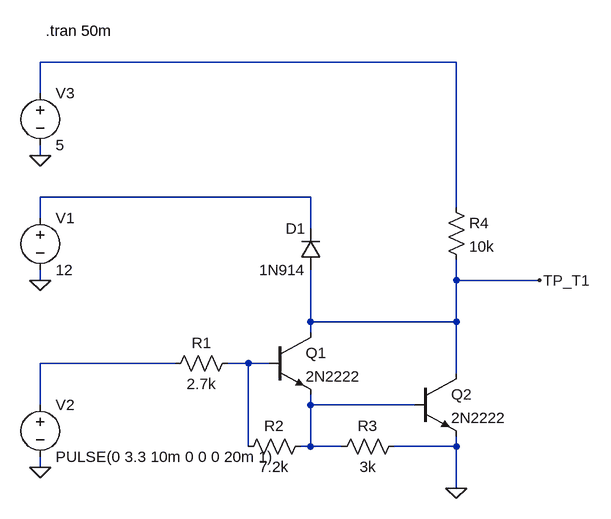
[diagram p0: schematic 4020 Control 1.asc]
4020 Control 1.asc, the LTspice schematic file:
Version 4
SHEET 1 880 680
WIRE 320 -288 -320 -288
WIRE -320 -240 -320 -288
WIRE -320 -144 -320 -160
WIRE 96 -80 -320 -80
WIRE 320 -64 320 -288
WIRE -320 -48 -320 -80
WIRE 96 -32 96 -80
WIRE -320 48 -320 32
WIRE 320 48 320 16
WIRE 448 48 320 48
WIRE 96 112 96 32
WIRE 320 112 320 48
WIRE 320 112 96 112
WIRE 96 128 96 112
WIRE -112 176 -320 176
WIRE 0 176 -32 176
WIRE 32 176 0 176
WIRE 320 192 320 112
WIRE -320 240 -320 176
WIRE 96 240 96 224
WIRE 256 240 96 240
WIRE 0 304 0 176
WIRE 96 304 96 240
WIRE 96 304 80 304
WIRE 144 304 96 304
WIRE 320 304 320 288
WIRE 320 304 224 304
WIRE -320 336 -320 320
WIRE 320 368 320 304
FLAG 320 368 0
FLAG -320 48 0
FLAG -320 336 0
FLAG -320 -144 0
FLAG 448 48 TP_T1
SYMBOL npn 32 128 R0
SYMATTR InstName Q1
SYMATTR Value 2N2222
SYMBOL npn 256 192 R0
SYMATTR InstName Q2
SYMATTR Value 2N2222
SYMBOL res -16 160 R90
WINDOW 0 0 56 VBottom 2
WINDOW 3 32 56 VTop 2
SYMATTR InstName R1
SYMATTR Value 2.7k
SYMBOL res 96 288 R90
WINDOW 0 0 56 VBottom 2
WINDOW 3 32 56 VTop 2
SYMATTR InstName R2
SYMATTR Value 7.2k
SYMBOL res 240 288 R90
WINDOW 0 0 56 VBottom 2
WINDOW 3 32 56 VTop 2
SYMATTR InstName R3
SYMATTR Value 3k
SYMBOL voltage -320 -64 R0
WINDOW 123 0 0 Left 0
WINDOW 39 0 0 Left 0
SYMATTR InstName V1
SYMATTR Value 12
SYMBOL voltage -320 224 R0
WINDOW 123 0 0 Left 0
WINDOW 39 0 0 Left 0
SYMATTR InstName V2
SYMATTR Value PULSE(0 3.3 10m 0 0 0 20m 1)
SYMBOL diode 112 32 R180
WINDOW 0 24 64 Left 2
WINDOW 3 24 0 Left 2
SYMATTR InstName D1
SYMATTR Value 1N914
SYMBOL res 304 -80 R0
SYMATTR InstName R4
SYMATTR Value 10k
SYMBOL voltage -320 -256 R0
WINDOW 123 0 0 Left 0
WINDOW 39 0 0 Left 0
SYMATTR InstName V3
SYMATTR Value 5
TEXT -312 -336 Left 2 !.tran 50m

The netlist it stands for:
* 4020 Control 1.asc
Q1 TP_T1 N004 N005 0 2N2222
Q2 TP_T1 N005 0 0 2N2222
R1 N004 N003 2.7k
R2 N005 N004 7.2k
R3 0 N005 3k
V1 N002 0 12
V2 N003 0 PULSE(0 3.3 10m 0 0 0 20m 1)
D1 TP_T1 N002 1N914
R4 N001 TP_T1 10k
V3 N001 0 5
.model D D
.lib standard.dio
.model NPN NPN
.model PNP PNP
.lib standard.bjt
.tran 50m
.backanno
.end